# Altium schematic sheet Server mPCIe.schdoc
size 491 x 348 mm
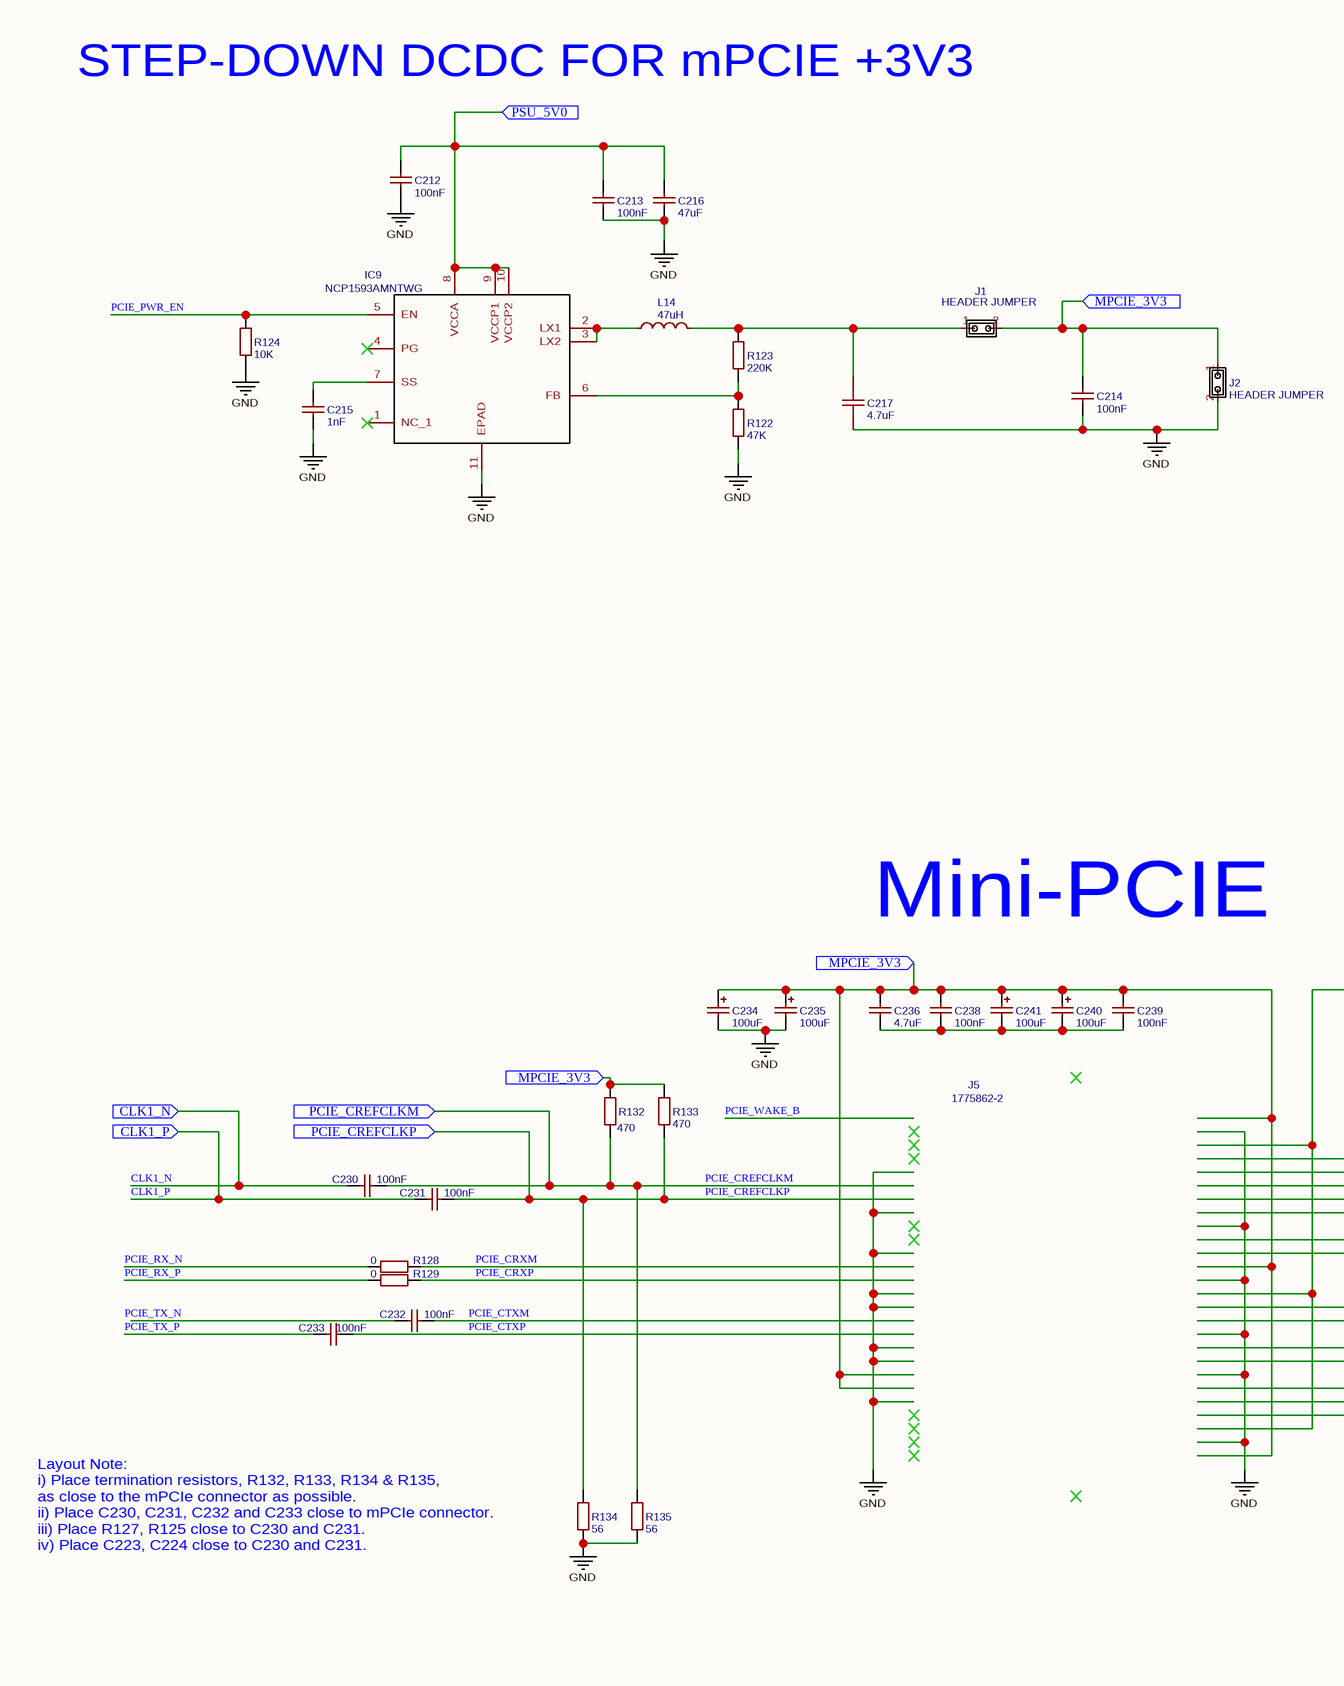
[diagram p0: Server mPCIe.schdoc, left]
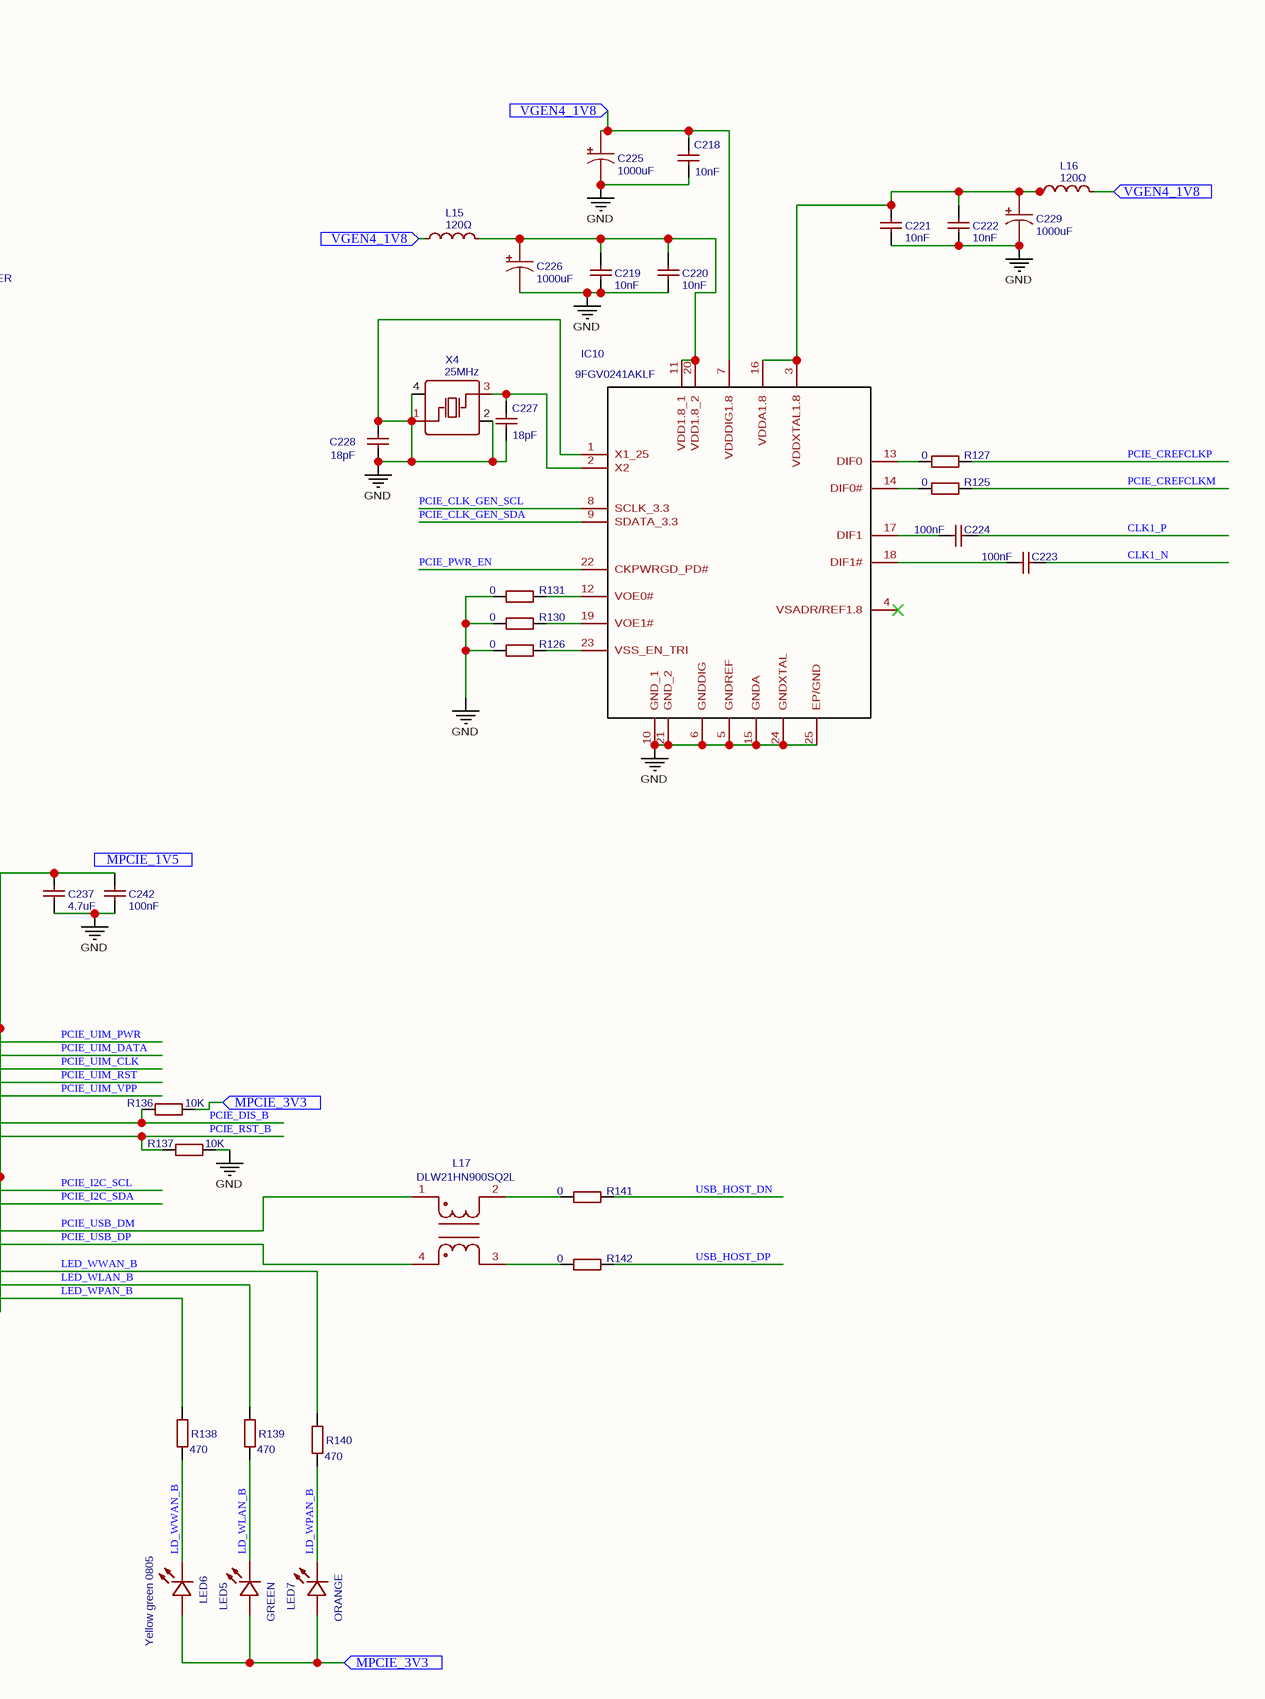
[diagram p1: Server mPCIe.schdoc, right]

## Parts
C212  100nF  [C0603]
C213  100nF  [C0603]
C214  100nF  [C0603]
C215  1nF  [C0805]
C216  47uF  [C0805]
C217  4.7uF  [C0402]
C218  10nF  [C0603]
C219  10nF  [C0603]
C220  10nF  [C0603]
C221  10nF  [C0603]
C222  10nF  [C0603]
C223  100nF  [C0402]
C224  100nF  [C0402]
C225  1000uF  [1000UF-25V-SMD-KONDANSATOR]
C226  1000uF  [1000UF-25V-SMD-KONDANSATOR]
C227  18pF  [C0402]
C228  18pF  [C0402]
C229  1000uF  [1000UF-25V-SMD-KONDANSATOR]
C230  100nF  [C0805]
C231  100nF  [C0805]
C232  100nF  [C0805]
C233  100nF  [C0805]
C234  100uF  [CAP-SMD_L3.5-W2.8-R-RD]
C235  100uF  [CAP-SMD_L3.5-W2.8-R-RD]
C236  4.7uF  [C0603]
C237  4.7uF  [C0603]
C238  100nF  [C0603]
C239  100nF  [C0603]
C240  100uF  [CAP-SMD_L3.5-W2.8-R-RD]
C241  100uF  [CAP-SMD_L3.5-W2.8-R-RD]
C242  100nF  [C0603]
IC9  NCP1593AMNTWG  [SON50P300X300X100-11N]
IC10  9FGV0241AKLF  [QFN50P400X400X100-25N]
J1  HEADER JUMPER  [HDR1X2]
J2  HEADER JUMPER  [HDR1X2]
J5  1775862-2  [17758622]
L14  47uH  [L0805]
L15  120Ω  [L0402]
L16  120Ω  [L0402]
L17  DLW21HN900SQ2L  [FILTER-SMD_4P-L2.0-W1.2-BL_DLW21H]
LED5  GREEN  [LED0603-R-RD]
LED6  Yellow green 0805  [LED0805-R-RD]
LED7  ORANGE  [LED0603-R-RD]
R122  47K  [R0402]
R123  220K  [R0402]
R124  10K  [R0603]
R125  0  [R0402]
R126  0  [R0402]
R127  0  [R0402]
R128  0  [R0402]
R129  0  [R0402]
R130  0  [R0402]
R131  0  [R0402]
R132  470  [R0402]
R133  470  [R0402]
R134  56  [R0402]
R135  56  [R0402]
R136  10K  [R0402]
R137  10K  [R0402]
R138  470  [R0402]
R139  470  [R0402]
R140  470  [R0402]
R141  0  [R0402]
R142  0  [R0402]
X4  25MHz  [OSC-SMD_4P-L3.2-W2.5-BL]

## Ports
CLK1_N (in), CLK1_P (in), MPCIE_1V5 (in), MPCIE_3V3 (in), PCIE_CREFCLKM (in), PCIE_CREFCLKP (in), PSU_5V0 (in), VGEN4_1V8 (in)

## Nets
GND: C212.1 C213.1 C214.1 C215.1 C216.1 C217.1 C218.1 C219.1 C220.1 C221.1 C222.1 C225.2 C226.2 C227.1 C228.1 C228.2 C229.2 C234.2 C235.2 C237.1 C242.1 IC9.11(EPAD) IC10.1(X1_25) IC10.5(GNDREF) IC10.6(GNDDIG) IC10.10(GND_1) IC10.15(GNDA) IC10.21(GND_2) IC10.24(GNDXTAL) IC10.25(EP/GND) J2.2 R122.1 R124.1 R126.1 R130.1 R131.1 R134.1 R135.1 R137.1 X4.1(OSC1) X4.2(GND) X4.4(GND)
CLK1_N: C223.2 C230.1 ; port CLK1_N
CLK1_P: C224.2 C231.1 ; port CLK1_P
LD_WLAN_B: LED5.2(K) R139.1
LD_WPAN_B: LED7.2(K) R140.1
LD_WWAN_B: LED6.2(K) R138.1
LED_WLAN_B: R139.2
LED_WPAN_B: R138.2
LED_WWAN_B: R140.2
MPCIE_3V3: C214.2 C234.1 C235.1 C236.2 C238.2 C239.2 C240.1 C241.1 J1.2 J2.1 LED5.1(A) LED6.1(A) LED7.1(A) R132.2 R133.2 R136.1 ; port MPCIE_3V3
PCIE_CLK_GEN_SCL: IC10.8(SCLK_3.3)
PCIE_CLK_GEN_SDA: IC10.9(SDATA_3.3)
PCIE_CREFCLKM: C230.2 R125.2 R132.1 R135.2 ; port PCIE_CREFCLKM
PCIE_CREFCLKP: C231.2 R127.2 R133.1 R134.2 ; port PCIE_CREFCLKP
PCIE_CRXM: R128.2
PCIE_CRXP: R129.2
PCIE_CTXM: C232.2
PCIE_CTXP: C233.2
PCIE_DIS_B: R136.2
PCIE_PWR_EN: IC9.5(EN) IC10.22(CKPWRGD_PD#) R124.2
PCIE_RST_B: R137.2
PCIE_RX_N: R128.1
PCIE_RX_P: R129.1
PCIE_TX_P: C233.1
PCIE_USB_DM: L17.1
PCIE_USB_DP: L17.4
PSU_5V0: C212.2 C213.2 C216.2 IC9.8(VCCA) IC9.9(VCCP1) IC9.10(VCCP2) ; port PSU_5V0
USB_HOST_DN: R141.2
USB_HOST_DP: R142.2
VGEN4_1V8: C218.2 C225.1 IC10.7(VDDDIG1.8) L15.1 L16.2 ; port VGEN4_1V8
NetC215_2: C215.2 IC9.7(SS)
NetC217_2: C217.2 J1.1 L14.2 R123.2
NetC219_2: C219.2 C220.2 C226.1 IC10.11(VDD1.8_1) IC10.20(VDD1.8_2) L15.2
NetC221_2: C221.2 C222.2 C229.1 IC10.3(VDDXTAL1.8) IC10.16(VDDA1.8) L16.1
NetC223_1: C223.1 IC10.18(DIF1#)
NetC224_1: C224.1 IC10.17(DIF1)
NetC227_2: C227.2 IC10.2(X2) X4.3(OSC2)
NetC236_1: C236.1 C238.1 C239.1 C240.2 C241.2
NetC237_2: C237.2 C242.2
NetIC9_2: IC9.2(LX1) IC9.3(LX2) L14.1
NetIC9_6: IC9.6(FB) R122.2 R123.1
NetIC10_12: IC10.12(VOE0#) R131.2
NetIC10_13: IC10.13(DIF0) R127.1
NetIC10_14: IC10.14(DIF0#) R125.1
NetIC10_19: IC10.19(VOE1#) R130.2
NetIC10_23: IC10.23(VSS_EN_TRI) R126.2
NetL17_2: L17.2 R141.1
NetL17_3: L17.3 R142.1

Not connected (* = marked no-connect by the designer): C232 1; IC9 1(NC_1)* 4(PG)*; IC10 4(VSADR/REF1.8)*

## Notes on the sheet
- STEP-DOWN DCDC FOR mPCIE +3V3
- Mini-PCIE
- Layout Note:
  i) Place termination resistors, R132, R133, R134 & R135,
  as close to the mPCIe connector as possible.
  ii) Place C230, C231, C232 and C233 close to mPCIe connector.
  iii) Place R127, R125 close to C230 and C231.
  iv) Place C223, C224 close to C230 and C231.
- Labels drawn without touching a wire or pin: PCIE_TX_N

## Library data of the parts
C212-C214 = 100nF: BOM_Manufacturer: WTC; BOM_Manufacturer Part: 0603B104K250; nameAlias: Capacitance; SMT Type: Extend; BOM_Supplier: LCSC; BOM_Supplier Part: C83054; BOM_LCSC Assembly: Yes; spicePre: C; spiceSymbolName: 0603B104K250
C215 = 1nF: BOM_Manufacturer Part: CL21B102KBCNNNC; BOM_Manufacturer: SAMSUNG; nameAlias: Capacitance; SMT Type: Basic; BOM_Supplier: LCSC; BOM_LCSC Assembly: Yes; BOM_Supplier Part: C46653; spicePre: C; spiceSymbolName: CL21B102KBCNNNC
C216 = 47uF: BOM_Manufacturer Part: CL21A476MQYNNNE; BOM_Manufacturer: SAMSUNG; nameAlias: Capacitance; SMT Type: Extend; BOM_Supplier: LCSC; BOM_Supplier Part: C16780; BOM_LCSC Assembly: Yes; spicePre: C; spiceSymbolName: CL21A476MQYNNNE
C217 = 4.7uF: BOM_Manufacturer: Samsung Electro-Mechanics; BOM_Manufacturer Part: CL05A475MQ5NRNC; nameAlias: Capacitance; Contributor: LCSC; SMT Type: Extend; BOM_Supplier: LCSC; BOM_Supplier Part: C307423; BOM_LCSC Assembly: Yes; spicePre: C; spiceSymbolName: CL05A475MQ5NRNC_C307423
C218-C222 = 10nF: BOM_Manufacturer: FH; BOM_Manufacturer Part: 0603B103K500NT; nameAlias: Capacitance; SMT Type: Basic; BOM_Supplier: LCSC; BOM_LCSC Assembly: Yes; BOM_Supplier Part: C57112; spicePre: C; spiceSymbolName: 0603B103K500NT
C223 C224 = 100nF: BOM_Manufacturer Part: CL05B104KO5NNNC; BOM_Manufacturer: SAMSUNG; nameAlias: Capacitance; SMT Type: Basic; BOM_Supplier: LCSC; BOM_LCSC Assembly: Yes; BOM_Supplier Part: C1525; spicePre: C; spiceSymbolName: CL05B104KO5NNNC
C225 C226 C229 = 1000uF: BOM_Manufacturer: ROQANG; BOM_Manufacturer Part: RVT1E102M1213; nameAlias: Capacitance; BOM_Supplier: LCSC; BOM_Supplier Part: C90271; spicePre: C; spiceSymbolName: 1000UF-25V-SMD-KONDANSATOR
C227 C228 = 18pF: BOM_Manufacturer: FH; BOM_Manufacturer Part: 0402CG180J500NT; nameAlias: Capacitance; SMT Type: Basic; BOM_Supplier: LCSC; BOM_LCSC Assembly: Yes; BOM_Supplier Part: C1549; spicePre: C; spiceSymbolName: 0402CG180J500NT
C230-C233 = 100nF: BOM_Manufacturer Part: CC0805KRX7R9BB104; BOM_Manufacturer: YAGEO; nameAlias: Capacitance; SMT Type: Basic; BOM_Supplier: LCSC; BOM_LCSC Assembly: Yes; BOM_Supplier Part: C49678; spicePre: C; spiceSymbolName: CC0805KRX7R9BB104
C234 C235 C240 C241 = 100uF: BOM_Manufacturer: AVX; BOM_Manufacturer Part: TAJB107M010RNJ; nameAlias: Capacitance; SMT Type: Extend; BOM_Supplier: LCSC; BOM_Supplier Part: C7196; BOM_LCSC Assembly: Yes; spicePre: C; spiceSymbolName: TAJB107M010RNJ
C236 C237 = 4.7uF: BOM_Manufacturer Part: CL10A475KO8NNNC; BOM_Manufacturer: SAMSUNG; nameAlias: Capacitance; SMT Type: Basic; BOM_Supplier: LCSC; BOM_LCSC Assembly: Yes; BOM_Supplier Part: C19666; spicePre: C; spiceSymbolName: CL10A475KO8NNNC
C238 C239 C242 = 100nF: BOM_Manufacturer Part: CL10B104JB8NNNC; BOM_Manufacturer: SAMSUNG; nameAlias: Capacitance; SMT Type: Extend; BOM_Supplier: LCSC; BOM_Supplier Part: C24452; BOM_LCSC Assembly: Yes; spicePre: C; spiceSymbolName: CL10B104JB8NNNC
IC9 = NCP1593AMNTWG: Contributor: Ke'Ondrae_Mell; spicePre: I; spiceSymbolName: NCP1593AMNTWG
IC10 = 9FGV0241AKLF: Contributor: Ke'Ondrae_Mell; spicePre: I; spiceSymbolName: 9FGV0241AKLF
J1 J2 = HEADER JUMPER: Contributor: iinnovations; sourceId: 5aKIigQpn; timeStamp: 1467472897; spicePre: J; spiceSymbolName: HEADER JUMPER
J5 = 1775862-2: Contributor: Ke'Ondrae_Mell; spicePre: J; spiceSymbolName: 1775862-2
L14 = 47uH: BOM_Manufacturer: MuRata; BOM_Manufacturer Part: LQM21FN470N00L; nameAlias: Inductance; SMT Type: Extend; BOM_Supplier: LCSC; BOM_Supplier Part: C86087; BOM_LCSC Assembly: Yes; spicePre: L; spiceSymbolName: LQM21FN470N00L
L15 L16 = 120Ω: BOM_Manufacturer: TDK; BOM_Manufacturer Part: MMZ1005F121ET000; nameAlias: Value; SMT Type: Extend; BOM_Supplier: LCSC; BOM_Supplier Part: C89458; BOM_LCSC Assembly: Yes; spicePre: L; spiceSymbolName: MMZ1005F121ET000
L17 = DLW21HN900SQ2L: BOM_Manufacturer: MuRata; nameAlias: Value(H); Value: 90Ω; BOM_Supplier: LCSC; BOM_Manufacturer Part: DLW21HN900SQ2L; BOM_Supplier Part: C97235; spicePre: L; spiceSymbolName: DLW21HN900SQ2L
LED5 = GREEN: BOM_Manufacturer: KENTO; BOM_Manufacturer Part: KT-0603R; SMT Type: Basic; BOM_Supplier: LCSC; BOM_LCSC Assembly: Yes; image: //image.lceda.cn/szlcsc/C2286.jpg; BOM_Supplier Part: C2286; spicePre: L; spiceSymbolName: KT-0603R
LED6 = Yellow green 0805: BOM_Manufacturer: KENTO; SMT Type: Extend; BOM_Supplier: LCSC; BOM_Manufacturer Part: Yellow green 0805; image: //image.lceda.cn/szlcsc/C2292.jpg; BOM_Supplier Part: C2292; BOM_LCSC Assembly: Yes; spicePre: L; spiceSymbolName: Yellow green 0805
LED7 = ORANGE: BOM_Manufacturer: KENTO; BOM_Manufacturer Part: KT-0603R; SMT Type: Basic; BOM_Supplier: LCSC; BOM_LCSC Assembly: Yes; image: //image.lceda.cn/szlcsc/C2286.jpg; BOM_Supplier Part: C2286; spicePre: L; spiceSymbolName: KT-0603R
R122 = 47K: BOM_Manufacturer: UniOhm; BOM_Manufacturer Part: 0402WGF4702TCE; nameAlias: Resistance (Ohms); SMT Type: Basic; BOM_Supplier: LCSC; BOM_LCSC Assembly: Yes; BOM_Supplier Part: C25792; spicePre: R; spiceSymbolName: 0402WGF4702TCE
R123 = 220K: BOM_Manufacturer: UniOhm; BOM_Manufacturer Part: 0402WGF2203TCE; nameAlias: Resistance (Ohms); SMT Type: Basic; BOM_Supplier: LCSC; BOM_LCSC Assembly: Yes; BOM_Supplier Part: C25767; spicePre: R; spiceSymbolName: 0402WGF2203TCE
R124 = 10K: BOM_Manufacturer: UniOhm; BOM_Manufacturer Part: 0603WAF1002T5E; nameAlias: Resistance (Ohms); SMT Type: Basic; BOM_Supplier: LCSC; BOM_LCSC Assembly: Yes; BOM_Supplier Part: C25804; spicePre: R; spiceSymbolName: 0603WAF1002T5E
R125-R131 R141 R142 = 0: BOM_Manufacturer: KOA; BOM_Manufacturer Part: RK73Z1ETTP; nameAlias: Resistance (Ohms); BOM_Supplier: LCSC; BOM_Supplier Part: C131359; spicePre: R; spiceSymbolName: RK73Z1ETTP
R132 R133 R138-R140 = 470: BOM_Manufacturer: UniOhm; BOM_Manufacturer Part: 0402WGF4700TCE; nameAlias: Resistance (Ohms); SMT Type: Basic; BOM_Supplier: LCSC; BOM_LCSC Assembly: Yes; BOM_Supplier Part: C25117; spicePre: R; spiceSymbolName: 0402WGF4700TCE
R134 R135 = 56: BOM_Manufacturer: LIZ; BOM_Manufacturer Part: CR0402JF0560G; nameAlias: Resistance (Ohms); BOM_Supplier: LCSC; BOM_Supplier Part: C100669; spicePre: R; spiceSymbolName: CR0402JF0560G
R136 R137 = 10K: BOM_Manufacturer: UniOhm; BOM_Manufacturer Part: 0402WGF1002TCE; nameAlias: Resistance (Ohms); SMT Type: Basic; BOM_Supplier: LCSC; BOM_LCSC Assembly: Yes; BOM_Supplier Part: C25744; spicePre: R; spiceSymbolName: 0402WGF1002TCE
X4 = 25MHz: BOM_Manufacturer: YXC; BOM_Manufacturer Part: X322525MOB4SI; nameAlias: Frequency; SMT Type: Basic; BOM_Supplier: LCSC; BOM_LCSC Assembly: Yes; BOM_Supplier Part: C9006; spicePre: X; spiceSymbolName: X322525MOB4SI